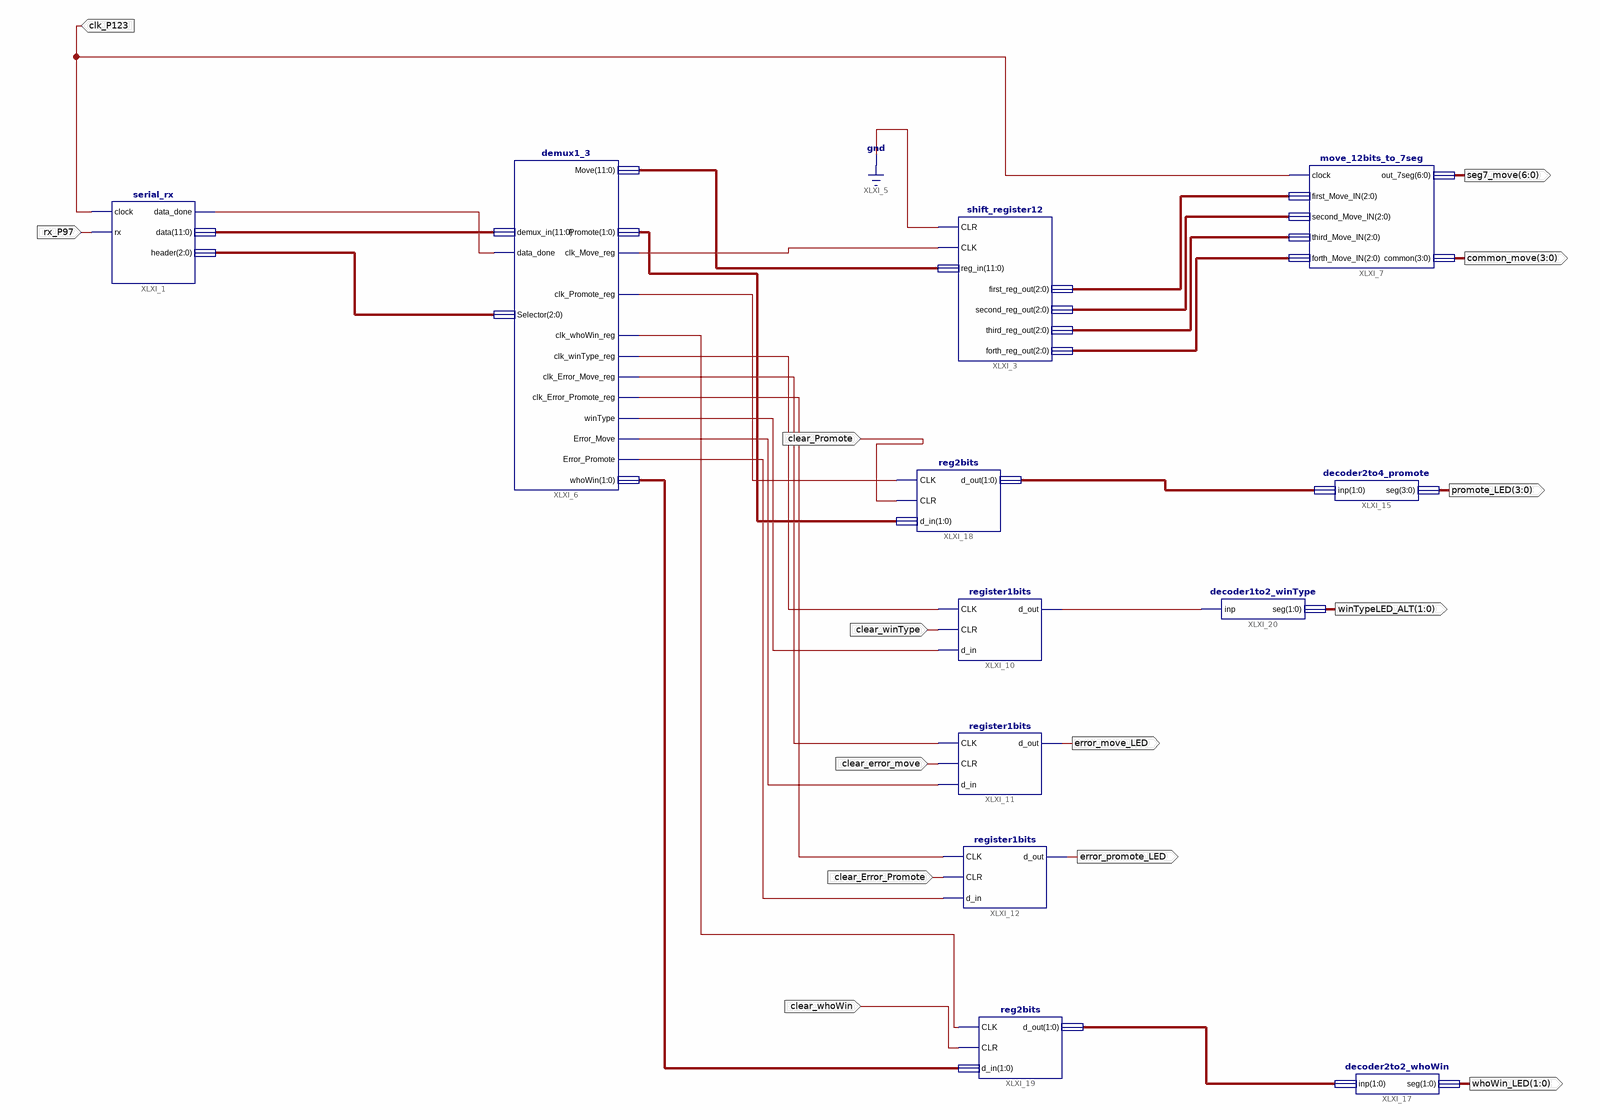
[diagram p0: schematic sheet 1]
// Xilinx ISE schematic rx.sch (spartan6) as structural Verilog: 12 symbols, 14 ports
module rx (
  input  rx_P97,
  input  clk_P123,
  input  clear_Promote,
  input  clear_Error_Promote,
  input  clear_error_move,
  input  clear_winType,
  input  clear_whoWin,
  output [6:0] seg7_move,
  output [3:0] common_move,
  output error_move_LED,
  output error_promote_LED,
  output [1:0] whoWin_LED,
  output [3:0] promote_LED,
  output [1:0] winTypeLED_ALT
);

  wire XLXN_20, XLXN_25, XLXN_74, XLXN_75, XLXN_76, XLXN_86, XLXN_87, XLXN_88, XLXN_113, XLXN_115, XLXN_119;
  wire [1:0] promote, XLXN_112, XLXN_116, XLXN_117;
  wire [2:0] XLXN_59, XLXN_61, XLXN_62, XLXN_63, XLXN_64;
  wire [11:0] XLXN_23, XLXN_60;

  shift_register12 XLXI_3 (
    .CLR(1'b0), .CLK(XLXN_25), .reg_in(XLXN_23), .first_reg_out(XLXN_61), .second_reg_out(XLXN_62),
    .third_reg_out(XLXN_63), .forth_reg_out(XLXN_64));
  serial_rx XLXI_1 (.clock(clk_P123), .rx(rx_P97), .data_done(XLXN_20), .header(XLXN_59), .data(XLXN_60));
  demux1_3 XLXI_6 (
    .data_done(XLXN_20), .demux_in(XLXN_60), .Selector(XLXN_59), .clk_Move_reg(XLXN_25),
    .clk_Promote_reg(XLXN_113), .Move(XLXN_23), .Promote(promote), .clk_whoWin_reg(XLXN_115),
    .clk_winType_reg(XLXN_86), .clk_Error_Move_reg(XLXN_87), .clk_Error_Promote_reg(XLXN_88),
    .winType(XLXN_74), .Error_Move(XLXN_75), .Error_Promote(XLXN_76), .whoWin(XLXN_116));
  move_12bits_to_7seg XLXI_7 (
    .clock(clk_P123), .first_Move_IN(XLXN_61), .second_Move_IN(XLXN_62), .third_Move_IN(XLXN_63),
    .forth_Move_IN(XLXN_64), .out_7seg(seg7_move), .common(common_move));
  register1bits XLXI_10 (.CLK(XLXN_86), .CLR(clear_winType), .d_in(XLXN_74), .d_out(XLXN_119));
  register1bits XLXI_11 (.CLK(XLXN_87), .CLR(clear_error_move), .d_in(XLXN_75), .d_out(error_move_LED));
  register1bits XLXI_12 (.CLK(XLXN_88), .CLR(clear_Error_Promote), .d_in(XLXN_76), .d_out(error_promote_LED));
  decoder2to4_promote XLXI_15 (.inp(XLXN_112), .seg(promote_LED));
  decoder2to2_whoWin XLXI_17 (.inp(XLXN_117), .seg(whoWin_LED));
  reg2bits XLXI_18 (.CLK(XLXN_113), .CLR(clear_Promote), .d_in(promote), .d_out(XLXN_112));
  reg2bits XLXI_19 (.CLK(XLXN_115), .CLR(clear_whoWin), .d_in(XLXN_116), .d_out(XLXN_117));
  decoder1to2_winType XLXI_20 (.inp(XLXN_119), .seg(winTypeLED_ALT));
endmodule
